# Altium schematic sheet CPU.SchDoc: Soldeerstation
size A4; Revision: 1; SheetNumber: 1; SheetTotal: 5
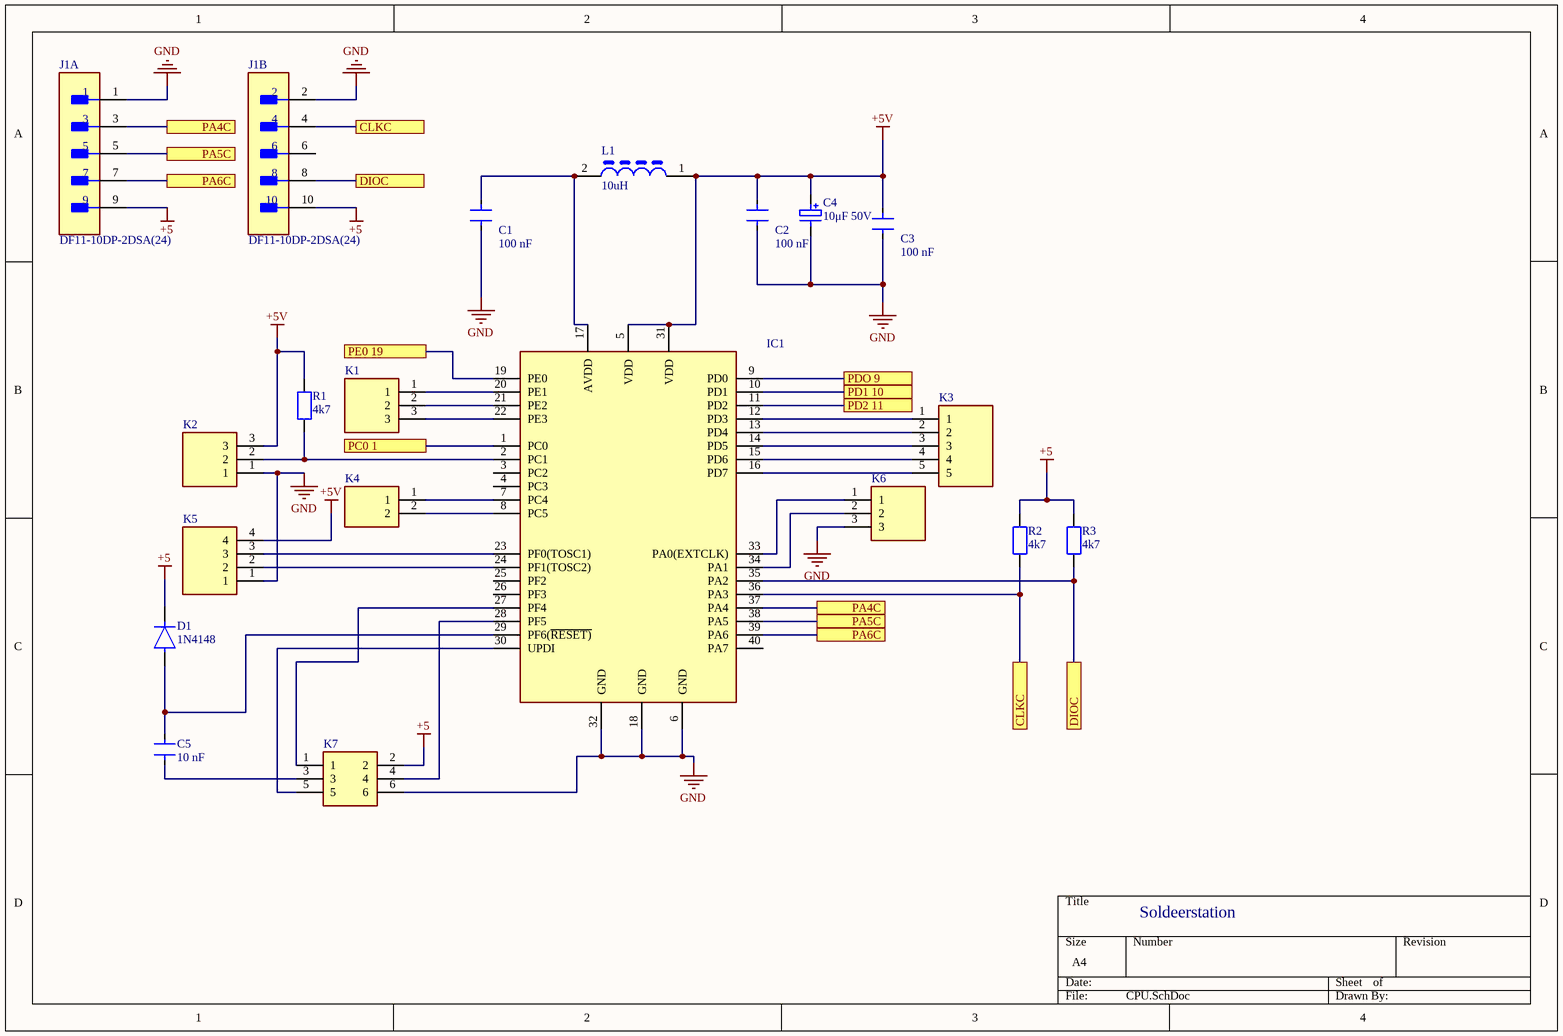
[diagram p0: CPU.SchDoc]

## Parts
C1  100 nF  [0805]
C2  100 nF  [0805]
C3  100 nF  [0805]
C4  10μF 50V  [Elco 10uF 50V]
C5  10 nF  [0805]
D1  1N4148  [1N4148]
IC1  ATMEGA4809-PF  [IC3]  (value not drawn)
J1  DF11-10DP-2DSA(24)  [FP-DF11-10DP-2DSA_24-MFG]  (parts A,B of 2)
K1  5-146280-3  [3 Pin Header]  (value not drawn)
K2  5-146280-3  [3 Pin Header]  (value not drawn)
K3  5-146280-5  [5 Pin Header]  (value not drawn)
K4  5-146280-2  [2 Pin Header]  (value not drawn)
K5  5-146280-4  [4 Pin Header]  (value not drawn)
K6  5-146280-3  [3 Pin Header]  (value not drawn)
K7  2x3 Pin Header  [2x3 Pin Header]  (value not drawn)
L1  10uH  [Smoorspoel]
R1  4k7  [Resistor]
R2  4k7  [Resistor]
R3  4k7  [Resistor]

## Ports
CLKC (see CPU[1A]), CLKC (see CPU[3C]), DIOC (see CPU[1A]), DIOC (see CPU[3C]), PA4C (see CPU[1A]), PA4C (see CPU[3C]), PA5C (see CPU[1A]), PA5C (see CPU[3C]), PA6C (see CPU[1A]), PA6C (see CPU[3C]), PC0 1 (see Regelaar[1B]), PD1 10 (see Versterker[1C]), PD2 11 (see Voeding[4B]), PDO 9 (see Versterker[1A]), PE0 19 (see Voeding[2B])

## Nets
+5: D1.1(C) J1.9 J1.10 K7.2 R2.2 R3.2
+5V: C2.1 C3.1 C4.1 IC1.5(VDD) IC1.31(VDD) K2.3 K5.4 L1.1 R1.2
GND: C1.2 C2.2 C3.2 C4.2 IC1.6(GND) IC1.18(GND) IC1.32(GND) J1.1 J1.2 K2.1 K5.1 K6.3 K7.6
CLKC: IC1.36(PA3) J1.4 R2.1 ; port CLKC
DIOC: IC1.35(PA2) J1.8 R3.1 ; port DIOC
PA4C: IC1.37(PA4) J1.3 ; port PA4C
PA5C: IC1.38(PA5) J1.5 ; port PA5C
PA6C: IC1.39(PA6) J1.7 ; port PA6C
PC0 1: IC1.1(PC0) ; port PC0 1
PD1 10: IC1.10(PD1) ; port PD1 10
PD2 11: IC1.11(PD2) ; port PD2 11
PDO 9: IC1.9(PD0) ; port PDO 9
PE0 19: IC1.19(PE0) ; port PE0 19
NetC1_1: C1.1 IC1.17(AVDD) L1.2
NetC5_1: C5.1 K7.3
NetC5_2: C5.2 D1.2(A) IC1.29(PF6(~{RESET)})
NetIC1_2: IC1.2(PC1) K2.2 R1.1
NetIC1_7: IC1.7(PC4) K4.1
NetIC1_8: IC1.8(PC5) K4.2
NetIC1_12: IC1.12(PD3) K3.1
NetIC1_13: IC1.13(PD4) K3.2
NetIC1_14: IC1.14(PD5) K3.3
NetIC1_15: IC1.15(PD6) K3.4
NetIC1_16: IC1.16(PD7) K3.5
NetIC1_20: IC1.20(PE1) K1.1
NetIC1_21: IC1.21(PE2) K1.2
NetIC1_22: IC1.22(PE3) K1.3
NetIC1_23: IC1.23(PF0(TOSC1)) K5.3
NetIC1_24: IC1.24(PF1(TOSC2)) K5.2
NetIC1_27: IC1.27(PF4) K7.1
NetIC1_28: IC1.28(PF5) K7.4
NetIC1_30: IC1.30(UPDI) K7.5
NetIC1_33: IC1.33(PA0(EXTCLK)) K6.1
NetIC1_34: IC1.34(PA1) K6.2

Not connected (* = marked no-connect by the designer): IC1 3(PC2) 4(PC3) 25(PF2) 26(PF3) 40(PA7); J1 6

## Notes on the sheet
- Soldeerstation

## Library data of the parts
C1-C3 C5 = Condensator 0805: Chip Multilayer Ceramic Capacitors for General Purpose, 0805, 10uF, X5R, 15%, 10%, 25V; Length: 2mm; Depth: 1.25mm; Termination: SMD/SMT; Voltage: 25V; Height: 1.25mm; Material: Ceramic; Thickness: 0.053inch; Radiation Hardening: No; Min Operating Temperature: -55°C; Width: 0.049inch; Package Quantity: 1; Mount: Surface Mount; Dielectric: X5R; Packaging: Tape and Reel; Capacitance: 10uF; Voltage Rating (DC): 25V; Lead Free: Lead Free; Max Operating Temperature: 85°C; Case Code (Imperial): 0805; Case/Package: 0805; Tolerance: 10%; Voltage Rating: 25V; Case Code (Metric): 2012
C4 = Condensator Elco: Part Number: 02015A270JAT2A; Manufacturer: AVX Interconnect / Elco
D1 = 1N4148: 1N4148, 100 V, 200 mA, 4 ns; Reverse Voltage: 100V; Forward Voltage: 1V; Output Current: 200mA; Max Power Dissipation: 500mW; Max Reverse Current: 5uA; Forward Current: 300mA; Current: 4A; Reverse Recovery Time: 4ns; Element Configuration: Single; Outside Diameter: 1.85mm; Capacitance: 4pF; Polarity: Standard; Max Forward Surge Current (Ifsm): 1A; Average Rectified Current: 200mA; Diameter: 1.91mm; Max Repetitive Reverse Voltage (Vrrm): 100V; Current Rating: 200mA; Case/Package: DO-35; Lead Free: Lead Free; Number of Pins: 2; Recovery Time: 4ns; Packaging: Bulk; Contact Plating: Tin; Voltage: 100V; Mount: Through Hole; Max Surge Current: 4A; Package Quantity: 2000; Width: 1.91mm; Max Reverse Voltage (DC): 100V; Length: 4.56mm; Radiation Hardening: No; Power Dissipation: 500mW; Voltage Rating (DC): 100V; Peak Non-Repetitive Surge Current: 4A; REACH SVHC: No SVHC; Height: 4.56mm; Max Operating Temperature: 175°C; Series: -; Weight: 0.01lb; Min Operating Temperature: -65°C
IC1 = IC3: RoHS Compliant: Yes
J1 = CMP-11610-000008-1: CONN HEADER VERT 10POS 2MM; Manufacturer: Hirose; Number Of Contacts: 10; Voltage Rating: 250V; Conn Orientation: Straight; Conn Gender: Male; Current Rating: 2A; Temperature Range High: +85°C; RoHS: TRUE; Device Class L2: Headers and Wire Housings; ComponentLink2URL: https://www.hirose.com/product/document?clcode=CL0543-0520-0-24&productname=DF11-10DP-2DSA(24)&series=DF11&documenttype=Catalog&lang=en&documentid=D31688_en; Height: 6.9mm; Package: DF11-10DP-2DSA(24); ComponentLink2Description: Datasheet; Automotive: No; Digikey Description: CONN HEADER VERT 10POS 2MM; Manufacturer Part Number: DF11-10DP-2DSA(24); Temperature: -40°C to +85°C; Octopart: https://octopart.com/df11-10dp-2dsa%2824%29-hirose-39521433; Number Of Rows: 2; Device Class L3: unset; Contact Material: Tin,Nickel; Mouser Description: Headers & Wire Housings 10P STRT HEADER THRU HL,BD MNT,SN; Category: Conn; Device Class L1: Connectors; Temperature Range Low: -40°C; Pitch: 2mm; Lead Free: Yes; Footprint Url: https://www.hirose.com/product/document?clcode=CL0543-0520-0-24&productname=DF11-10DP-2DSA(24)&series=DF11&documenttype=2DDrawing&lang=en&documentid=0000995333
K1 K2 K6 = 3 Pin Header: Connector 5-146280-3; Manufacturer_Name: TE Connectivity; Datasheet Link: https://componentsearchengine.com//5-146280-3.pdf; Height: 8.21mm; Mouser2 Part Number: 571-5-146280-3; Mouser2 Price/Stock: https://www.mouser.com/Search/Refine.aspx?Keyword=571-5-146280-3; Manufacturer_Part_Number: 5-146280-3
K3 = 5 Pin Header: Connector 5-146280-5; Manufacturer_Name: TE Connectivity; Datasheet Link: https://componentsearchengine.com//5-146280-5.pdf; Height: 8.21mm; Mouser2 Part Number: 571-5-146280-5; Mouser2 Price/Stock: https://www.mouser.com/Search/Refine.aspx?Keyword=571-5-146280-5; Manufacturer_Part_Number: 5-146280-5
K4 = 2 Pin Header: Connector; Manufacturer_Name: TE Connectivity; Datasheet Link: http://www.te.com/commerce/DocumentDelivery/DDEController?Action=showdoc&DocId=Customer+Drawing%7F146280%7FH2%7Fpdf%7FEnglish%7FENG_CD_146280_H2.pdf%7F5-146280-2; Height: 8.72mm; Manufacturer_Part_Number: 5-146280-2
K5 = 4 Pin Header: Connector 5-146280-4; Manufacturer_Name: TE Connectivity; Datasheet Link: https://datasheet.datasheetarchive.com/originals/distributors/DKDS-20/396066.pdf; Height: 8.21mm; Manufacturer_Part_Number: 5-146280-4
K7 = 2x3 Pin Header: Connector; Manufacturer_Name: TE Connectivity; Manufacturer_Part_Number: 5-146256-3; Datasheet Link: https://www.te.com/commerce/DocumentDelivery/DDEController?Action=srchrtrv&DocNm=146256&DocType=Customer+Drawing&DocLang=English; Height: 8.72mm
L1 = Smoorspoel: Inductor VLS6045EX-100M-H; Manufacturer_Name: TDK; Datasheet Link: https://componentsearchengine.com//VLS6045EX-100M-H.pdf; Mouser2 Part Number: 810-VLS6045EX-100M-H; Mouser2 Price/Stock: https://www.mouser.com/Search/Refine.aspx?Keyword=810-VLS6045EX-100M-H; Manufacturer_Part_Number: VLS6045EX-100M-H
R1-R3 = Resistor: Manufacturer: Vishay Dale; Part Number: CRCW08050000Z0EA